# EAGLE design Arduino-Pro-Mini-RasPi (EAGLE 6.5.0)
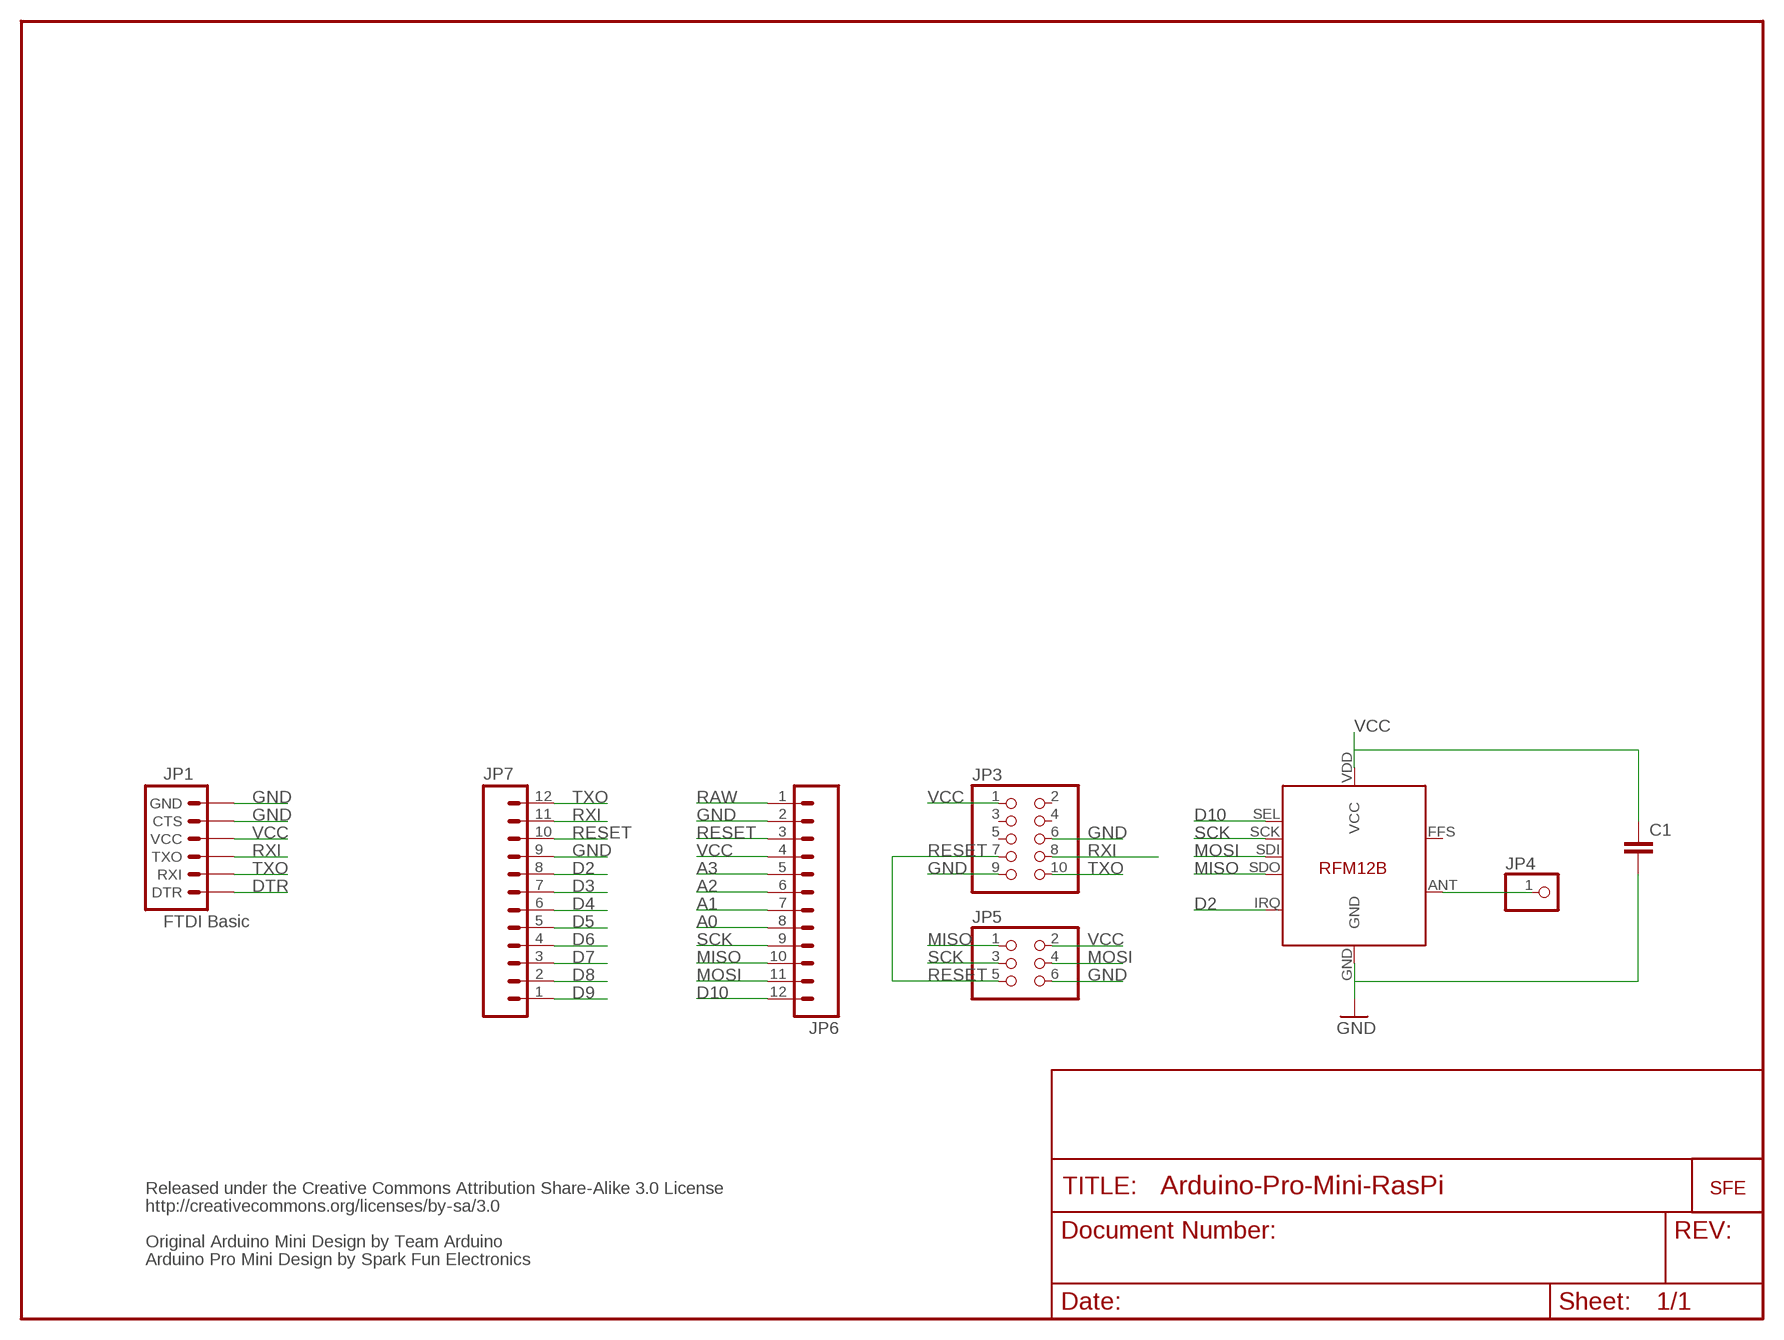
[diagram p0: schematic, sheet 1]

## Parts
C1  C-EUC0805K  [C0805K]
JP1  FTDI Basic  ARDUINO_SERIAL_PROGRAMPTH  [1X06]
JP3  PINHD-2X5  [2X05]
JP4  PINHD-1X1  [1X01]
JP5  PINHD-2X3_2.54-SMD  [2X03SMD]
JP6  M12PTH  [1X12]
JP7  M12PTH  [1X12]
U$3  RFM12B  [RFM12B]
U$11  LOGO-SFENEW  [SFE-NEW-WEBLOGO]

## Nets
A0: JP6.8
A1: JP6.7
A2: JP6.6
A3: JP6.5
D2: JP7.8 U$3.IRQ
D3: JP7.7
D4: JP7.6
D5: JP7.5
D6: JP7.4
D7: JP7.3
D8: JP7.2
D9: JP7.1
D10: JP6.12 U$3.SEL
DTR: JP1.1(DTR)
GND [vcc]: C1.2 JP1.5(CTS) JP1.6(GND) JP3.6 JP3.9 JP5.6 JP6.2 JP7.9 U$3.GND
MISO: JP5.1 JP6.10 U$3.SDO
MOSI: JP5.4 JP6.11 U$3.SDI
N$3: JP4.1 U$3.ANT
RAW [vcc]: JP6.1
RESET: JP3.7 JP5.5 JP6.3 JP7.10
RXI: JP1.3(TXO) JP3.8 JP7.11
SCK: JP5.3 JP6.9 U$3.SCK
TXO: JP1.2(RXI) JP3.10 JP7.12
VCC: C1.1 JP1.4(VCC) JP3.1 JP5.2 JP6.4 U$3.VDD(VCC)
Unconnected: JP3.2 JP3.3 JP3.4 JP3.5 U$3.FFS

## Notes on the sheet
- Released under the Creative Commons Attribution Share-Alike 3.0 License
- http://creativecommons.org/licenses/by-sa/3.0
- Original Arduino Mini Design by Team Arduino
- Arduino Pro Mini Design by Spark Fun Electronics

## Library data of the parts
C1 = rcl:C-EU: CAPACITOR, European symbol
JP1 = SparkFun:ARDUINO_SERIAL_PROGRAM
JP3 = pinhead:PINHD-2X5: PIN HEADER
JP4 = pinhead:PINHD-1X1: PIN HEADER
JP5 = pinhead-1:PINHD-2X3: PIN HEADER
JP6 JP7 = SparkFun:M12: Header 12 Standard 12-pin 0.1" header. Use with straight break away headers (SKU : PRT-00116), right angle break away headers (PRT-00553), swiss pins (PRT-00743), machine pins (PRT-00117), and female headers (PRT-00115).
U$3 = JeeParts:RFM12B
U$11 = SparkFun:LOGO-SFE: Spark Fun Electronics PCB Logo This is the standard Spark Fun Electronics PCB logo.

## Net classes
0 default: width 0.203 mm
1 vcc: width 0.254 mm

## Board
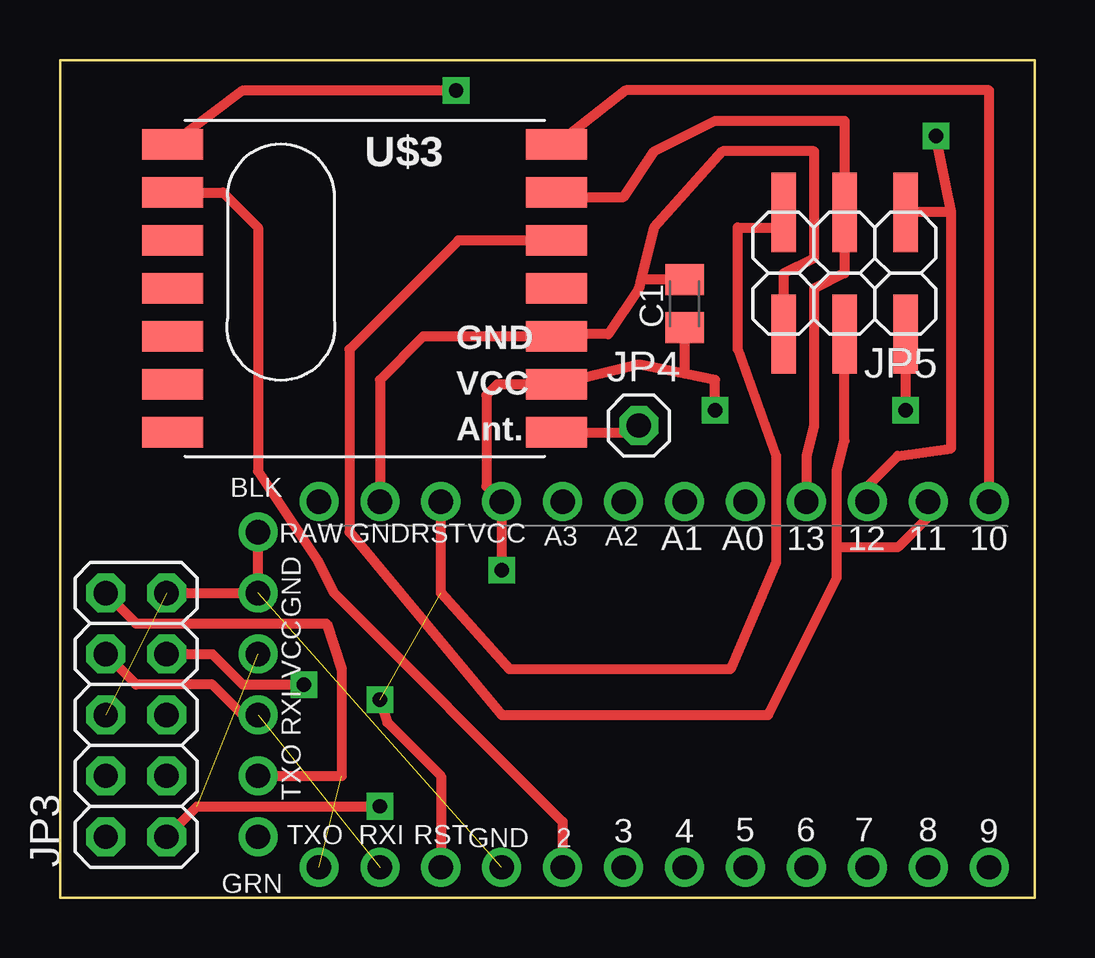
[diagram p1: board, top side]
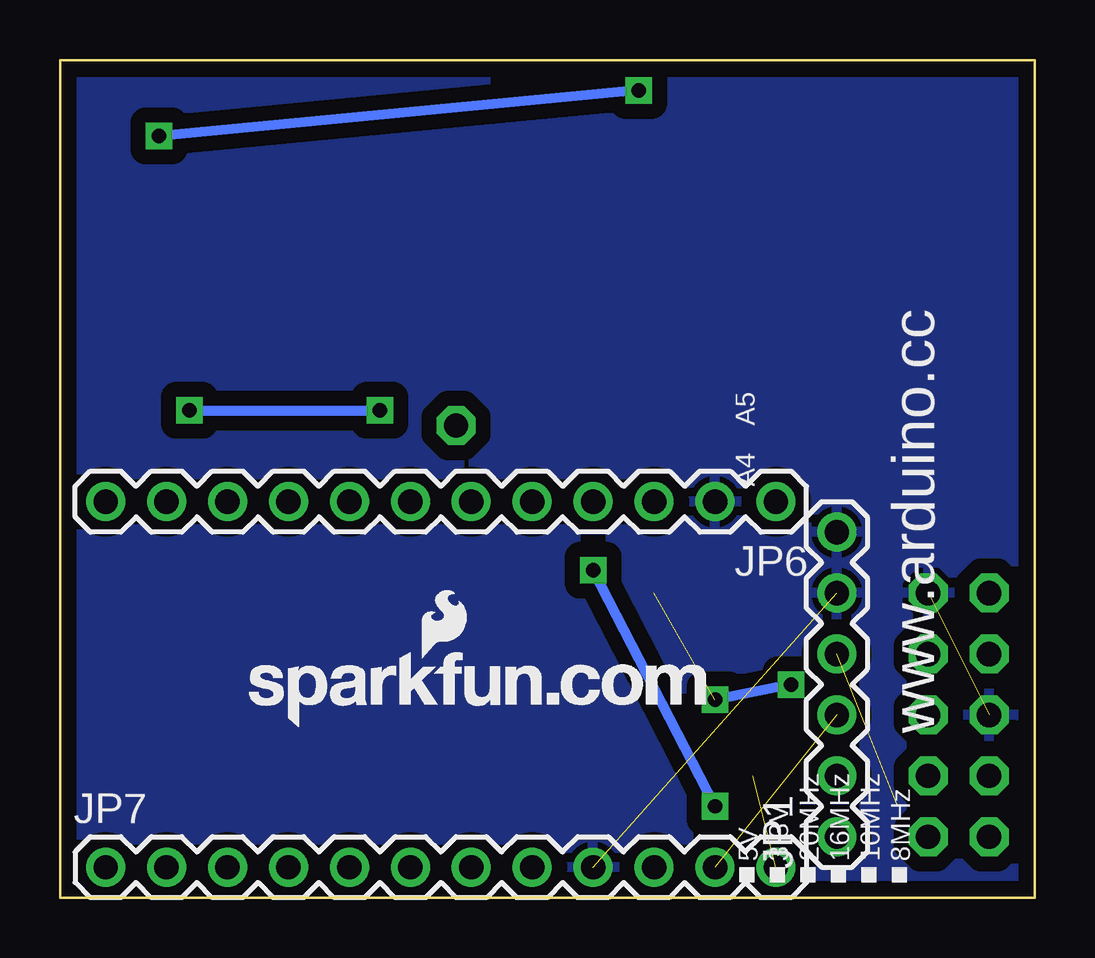
[diagram p2: board, bottom side, seen from below]

Size 40.64 x 34.92 mm. Coordinates in mm from the lower left corner, seen from the top.
Outline: 0,34.92 0,0 40.64,0 40.64,34.92 0,34.92
Copper layers (1*16): Top 0.035mm / dielectric 1.5mm / Bottom 0.035mm
Design rules "SparkFun *": minimum track width 8mil, minimum drill 20mil, track to track 8mil, track to pad 8mil, pad to pad 8mil, via to via 8mil, smd to smd 8mil, copper to edge 10mil, drill to drill 8mil, minimum pad ring 12mil, minimum via ring 10mil, stop-mask expansion 4mil, vias tented up to drill 20mil, thermal gap 10mil

### Footprints (pad centres in the part's own frame; a part is rotated, then mirrored left to right if it is on the bottom)
C0805K = smd 1.3 x 1.6: 1 -1,0; 2 1,0
1X06 = drill 1.016: 1 0,0; 2 2.54,0; 3 5.08,0; 4 7.62,0; 5 10.16,0; 6 12.7,0
2X05 = drill 1.016 octagon: 1 -5.08,-1.27; 2 -5.08,1.27; 3 -2.54,-1.27; 4 -2.54,1.27; 5 0,-1.27; 6 0,1.27; 7 2.54,-1.27; 8 2.54,1.27; 9 5.08,-1.27; 10 5.08,1.27
1X01 = drill 1.016 octagon: 1 0,0
2X03SMD = smd 1.016 x 3.302: 1 -1.27,-3.81; 2 -1.27,1.27; 3 1.27,-3.81; 4 1.27,1.27; 5 3.81,-3.81; 6 3.81,1.27
1X12 = drill 1.016: 1 0,0; 2 2.54,0; 3 5.08,0; 4 7.62,0; 5 10.16,0; 6 12.7,0; 7 15.24,0; 8 17.78,0; 9 20.32,0; 10 22.86,0; 11 25.4,0; 12 27.94,0
RFM12B = smd 2.54 x 1.27: ANT 8,-6; FFS -8,2; GND 8,-2; IRQ -8,4; P$8 -8,0; P$9 -8,-2; P$10 -8,-4; P$12 -8,-6; P$16 8,0; SCK 8,4; SDI 8,2; SDO -8,6; SEL 8,6; VDD 8,-4

### Placement (x,y rotation side)
C1  26.04,24.77 90 top
JP1  8.26,2.54 90 bottom
JP3  3.17,7.62 90 top
JP4  24.13,19.68 0 top
JP5  33.97,24.77 180 top
JP6  10.79,16.51 180 bottom
JP7  38.73,1.27 0 bottom
U$3  12.7,25.4 0 top
U$11  32.77,7.11 0 bottom

### Tracks (layer width: path | path; a pad name or v marks a point on that pad's centre or on a via)
D2
  Top 0.406: U$3.IRQ 6.79,29.4 8.26,27.94 8.26,17.78 10.79,13.97 11.43,12.7 20.95,3.17 JP7.8
D10
  Top 0.406: JP6.12 38.73,33.66 23.59,33.66 U$3.SEL
GND  (2 unrouted)
  Top 0.406: JP6.2 13.34,21.59 15.14,23.4 U$3.GND 20.8,23.5 22.86,23.5 24.13,25.4 24.2,25.7 | 24.2,25.7 24.77,27.94 27.62,31.11 31.43,31.11 31.43,26.67 30.16,26.04 JP5.6 | C1.2 24.27,25.77 24.2,25.7 | JP3.9 JP1.5 JP1.6
  pour Bottom (isolate 0.635): 0,34.92 40.64,34.92 40.64,0 0,0
MISO  (via drill 0.6)
  Top 0.406: U$3.SDO 5.05,31.75 5.08,31.75 7.62,33.66 v16.51,33.66 | 37.15,28.57 37.15,18.73 34.92,18.41 33.66,17.14 JP6.10 | 37.15,28.57 JP5.1 | 37.15,28.57 v36.51,31.75
  Bottom 0.406: v16.51,33.66 v36.51,31.75
MOSI
  Top 0.406: U$3.SDI 16.61,27.4 12.06,22.86 12.06,15.24 18.41,7.62 29.53,7.62 32.38,13.34 32.38,14.61 | 32.38,14.61 32.38,17.78 32.7,19.05 JP5.4 | JP6.11 36.2,15.88 34.92,14.61 32.38,14.61
N$3
  Top 0.406: U$3.ANT 23.84,19.4 JP4.1
RESET  (via drill 0.6)  (1 unrouted)
  Top 0.406: JP6.3 15.88,12.7 18.73,9.53 27.94,9.53 29.84,13.97 29.84,18.41 28.26,22.86 28.26,27.94 30.16,27.94 JP5.5 | JP3.7 6.35,10.16 7.62,8.89 v10.16,8.89 | JP7.10 15.88,5.08 13.65,7.3 v13.34,8.26
  Bottom 0.406: v10.16,8.89 v13.34,8.26
RXI  (1 unrouted)
  Top 0.406: JP3.8 3.17,8.89 6.35,8.89 7.62,7.62 JP1.3
SCK
  Top 0.406: U$3.SCK 21.14,29.21 23.5,29.21 24.77,31.11 27.3,32.38 32.7,32.38 JP5.3 32.7,26.04 31.43,25.4 31.43,19.68 31.11,18.41 JP6.9
TXO  (1 unrouted)
  Top 0.406: JP1.2 11.75,5.08 11.75,9.53 11.11,11.43 3.17,11.43 JP3.10
VCC  (via drill 0.6)  (1 unrouted)
  Top 0.406: JP5.2 v35.24,20.32 | v27.3,20.32 27.3,21.59 26.08,21.83 | 26.08,21.83 24.13,22.23 U$3.VDD 18.23,21.4 17.78,20.95 17.78,17.14 JP6.4 v18.41,13.65 | JP3.1 5.71,3.81 v13.34,3.81 | C1.1 26.04,21.88 26.08,21.83
  Bottom 0.406: v35.24,20.32 v27.3,20.32 | v18.41,13.65 v13.34,3.81

### Text on the board
tPlace: BLK | RAW | GND | RST | VCC | A3 | A2 | A1 | A0 | 13 | 12 | 11 | 10 | GND | VCC | RXI | TXO | TXO | RXI | RST | GND | 2 | 3 | 4 | 5 | 6 | 7 | 8 | 9 | GRN
bPlace: A5 | A4 | www.arduino.cc | 8MHz | 10MHz | 16MHz | 20MHz | 3.3V | 5V
tValues: Tent Vias! | Arduino Wee v1.3